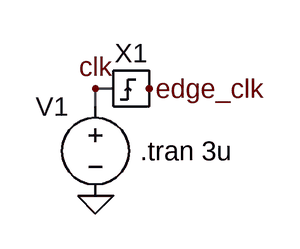
[diagram p0: schematic test-edge.asc]
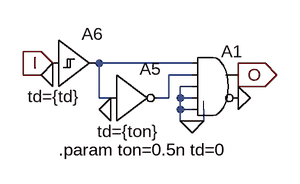
[diagram p1: sub-circuit edge.asc]
test-edge.asc, the LTspice schematic file:
Version 4
SHEET 1 880 680
WIRE 112 144 96 144
WIRE 96 160 96 144
FLAG 96 240 0
FLAG 144 144 edge_clk
FLAG 96 144 clk
SYMBOL edge 128 144 R0
WINDOW 0 0 -16 Bottom 2
SYMATTR InstName X1
SYMBOL voltage 96 144 M0
WINDOW 3 24 96 Invisible 2
WINDOW 123 0 0 Left 0
WINDOW 39 0 0 Left 0
SYMATTR InstName V1
SYMATTR Value PULSE(0 1 0.5u 1n 1n 0.5u 1u)
TEXT 136 200 Left 2 !.tran 3u

edge.asc, the sub-circuit schematic file:
Version 4
SHEET 1 880 680
WIRE 80 80 -48 80
WIRE 80 96 48 96
WIRE 80 112 64 112
WIRE -48 128 -48 80
WIRE -32 128 -48 128
WIRE 48 128 48 96
WIRE 48 128 32 128
WIRE 64 128 64 112
WIRE 80 128 64 128
WIRE 64 144 64 128
WIRE 80 144 64 144
WIRE 64 160 64 144
WIRE 80 160 64 160
WIRE 96 160 96 144
WIRE 96 160 80 160
FLAG -112 80 I
IOPIN -112 80 In
FLAG 80 160 0
FLAG 144 96 O
IOPIN 144 96 Out
FLAG -32 144 0
FLAG -112 96 0
FLAG 144 128 0
SYMBOL Digital\\and 112 48 R0
SYMATTR InstName A1
SYMBOL Digital\\inv -32 64 R0
WINDOW 3 -19 110 Left 2
SYMATTR Value td={ton}
SYMATTR InstName A5
SYMBOL Digital\\schmtbuf -112 16 R0
WINDOW 3 -35 110 Left 2
SYMATTR Value td={td}
SYMATTR InstName A6
TEXT -104 200 Left 2 !.param ton=0.5n td=0

The netlist it stands for:
* test-edge.asc
XX1 clk edge_clk edge
V1 clk 0 PULSE(0 1 0.5u 1n 1n 0.5u 1u)

* block symbol definitions
.subckt edge I O
A1 N001 N002 0 0 0 0 O 0 AND
A5 N001 0 0 0 0 N002 0 0 BUF td={ton}
A6 I 0 0 0 0 0 N001 0 SCHMITT td={td}
.param ton=0.5n td=0
.ends edge

.tran 3u
.backanno
.end